# Altium schematic sheet First_Sheet.SCHDOC
size 840 x 594 mm
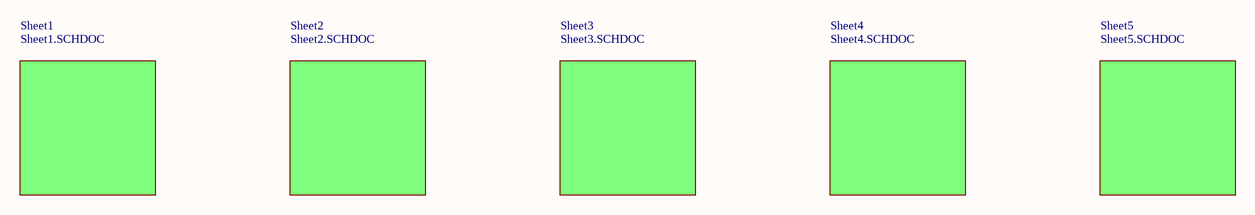
[diagram p0: First_Sheet.SCHDOC]

## Sub-sheets
Sheet1 = Sheet1.SCHDOC: no entries
Sheet2 = Sheet2.SCHDOC: no entries
Sheet3 = Sheet3.SCHDOC: no entries
Sheet4 = Sheet4.SCHDOC: no entries
Sheet5 = Sheet5.SCHDOC: no entries